# EAGLE design 1_cpu_mmu (EAGLE 6.6.0)

## Sheet 1 of 2
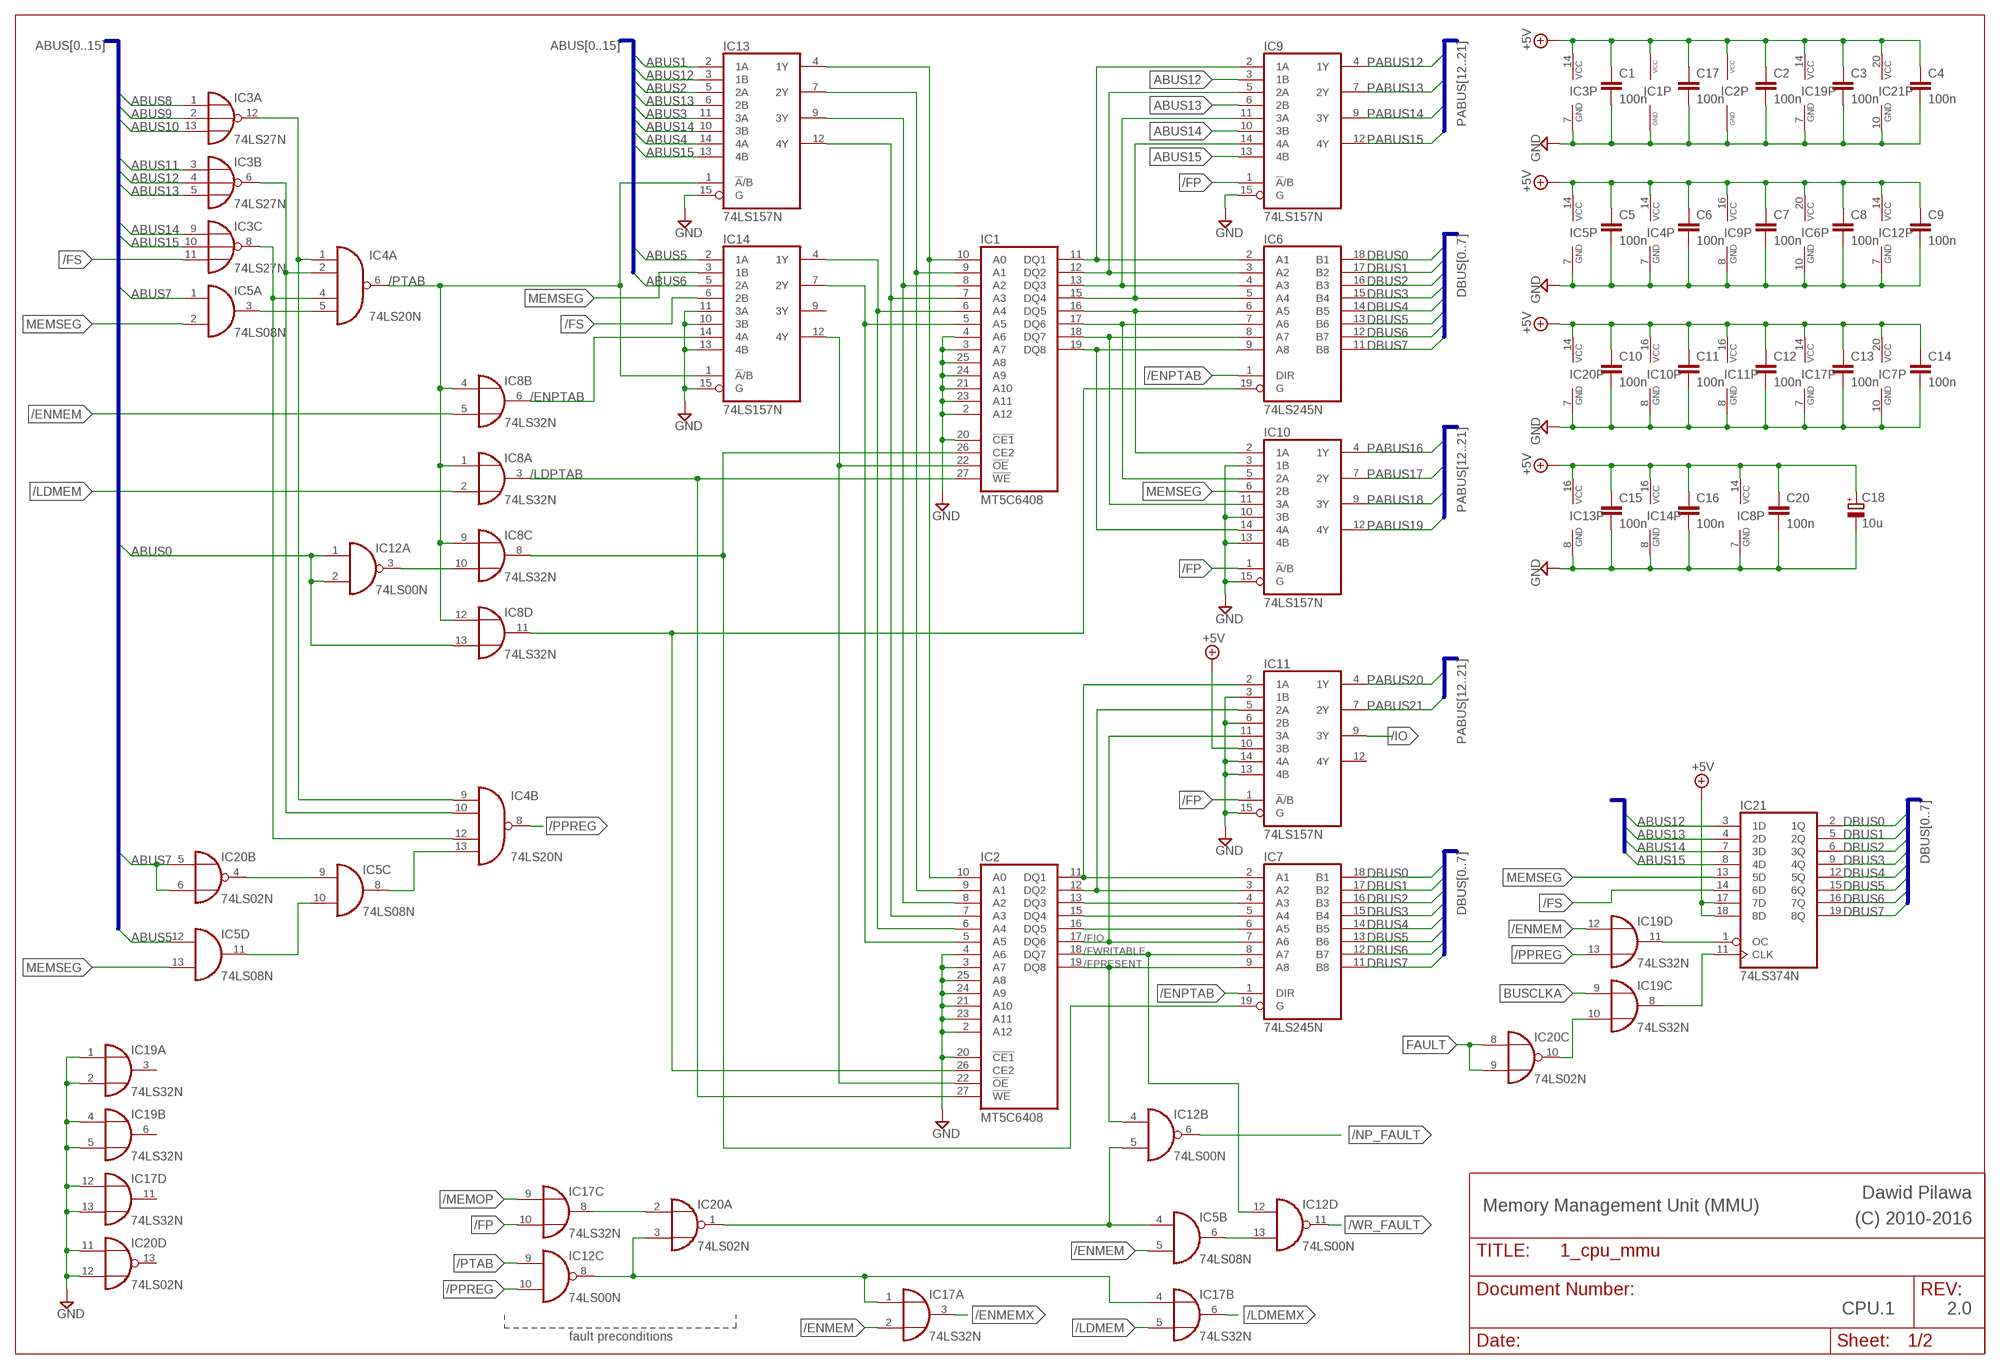
[diagram p0: schematic, sheet 1]

### Parts
C1  100n  C-EU050-024X044  [C050-024X044]
C2  100n  C-EU050-024X044  [C050-024X044]
C3  100n  C-EU050-024X044  [C050-024X044]
C4  100n  C-EU050-024X044  [C050-024X044]
C5  100n  C-EU050-024X044  [C050-024X044]
C6  100n  C-EU050-024X044  [C050-024X044]
C7  100n  C-EU050-024X044  [C050-024X044]
C8  100n  C-EU050-024X044  [C050-024X044]
C9  100n  C-EU050-024X044  [C050-024X044]
C10  100n  C-EU050-024X044  [C050-024X044]
C11  100n  C-EU050-024X044  [C050-024X044]
C12  100n  C-EU050-024X044  [C050-024X044]
C13  100n  C-EU050-024X044  [C050-024X044]
C14  100n  C-EU050-024X044  [C050-024X044]
C15  100n  C-EU050-024X044  [C050-024X044]
C16  100n  C-EU050-024X044  [C050-024X044]
C17  100n  C-EU050-024X044  [C050-024X044]
C18  10u  CPOL-EUE2.5-6  [E2,5-6]
C20  100n  C-EU050-024X044  [C050-024X044]
IC1  MT5C6408  [DIL28-3]
IC2  MT5C6408  [DIL28-3]
IC3  74LS27N  [DIL14]
IC4  74LS20N  [DIL14]
IC5  74LS08N  [DIL14]
IC6  74LS245N  [DIL20]
IC7  74LS245N  [DIL20]
IC8  74LS32N  [DIL14]
IC9  74LS157N  [DIL16]
IC10  74LS157N  [DIL16]
IC11  74LS157N  [DIL16]
IC12  74LS00N  [DIL14]
IC13  74LS157N  [DIL16]
IC14  74LS157N  [DIL16]
IC17  74LS32N  [DIL14]
IC19  74LS32N  [DIL14]
IC20  74LS02N  [DIL14]
IC21  74LS374N  [DIL20]

### Nets
+5V: C1.1 C2.1 C3.1 C4.1 C5.1 C6.1 C7.1 C8.1 C9.1 C10.1 C11.1 C12.1 C13.1 C14.1 C15.1 C16.1 C17.1 C18.+ C20.1 IC1.28(VCC) IC2.28(VCC) IC3.14(P:VCC) IC4.14(P:VCC) IC5.14(P:VCC) IC6.20(VCC) IC7.20(VCC) IC8.14(P:VCC) IC9.16(VCC) IC10.16(VCC) IC11.10(3B) IC11.16(VCC) IC12.14(P:VCC) IC13.16(VCC) IC14.16(VCC) IC17.14(P:VCC) IC19.14(P:VCC) IC20.14(P:VCC) IC21.17(7D) IC21.18(8D) IC21.20(VCC) ; also sheet 2
/ENMEM: IC5.5(B:I1) IC8.5(B:I1) IC17.2(A:I1) IC19.12(D:I0) ; also sheet 2
/ENMEMX: IC17.3(A:O) ; also sheet 2
/ENPTAB: IC6.1(DIR) IC7.1(DIR) IC8.6(B:O) IC14.14(4A)
/FIO: IC2.17(DQ6) IC7.7(A6) IC11.11(3A)
/FP: IC9.1(!A!/B) IC10.1(!A!/B) IC11.1(!A!/B) IC17.10(C:I1) ; also sheet 2
/FPRESENT: IC2.19(DQ8) IC7.9(A8) IC12.4(B:I0)
/FS: IC3.11(C:I2) IC14.6(2B) IC21.14(6D) ; also sheet 2
/FWRITABLE: IC2.18(DQ7) IC7.8(A7) IC12.12(D:I0)
/IO: IC11.9(3Y) ; also sheet 2
/LDMEM: IC8.2(A:I1) IC17.5(B:I1) ; also sheet 2
/LDMEMX: IC17.6(B:O) ; also sheet 2
/LDPTAB: IC1.27(!WE) IC2.27(!WE) IC8.3(A:O)
/MEMOP: IC17.9(C:I0) ; also sheet 2
/NP_FAULT: IC12.6(B:O) ; also sheet 2
/PPREG: IC4.8(B:O) IC12.10(C:I1) IC19.13(D:I1)
/PTAB: IC4.6(A:O) IC8.1(A:I0) IC8.4(B:I0) IC8.9(C:I0) IC8.12(D:I0) IC12.9(C:I0) IC13.1(!A!/B) IC14.1(!A!/B)
/WR_FAULT: IC12.11(D:O) ; also sheet 2
ABUS0: IC8.13(D:I1) IC12.1(A:I0) IC12.2(A:I1) ; also sheet 2
ABUS1: IC13.2(1A) ; also sheet 2
ABUS2: IC13.5(2A) ; also sheet 2
ABUS3: IC13.11(3A) ; also sheet 2
ABUS4: IC13.14(4A) ; also sheet 2
ABUS5: IC5.12(D:I0) IC14.2(1A) ; also sheet 2
ABUS6: IC14.5(2A) ; also sheet 2
ABUS7: IC5.1(A:I0) IC20.5(B:I0) IC20.6(B:I1) ; also sheet 2
ABUS8: IC3.1(A:I0) ; also sheet 2
ABUS9: IC3.2(A:I1) ; also sheet 2
ABUS10: IC3.13(A:I2) ; also sheet 2
ABUS11: IC3.3(B:I0) ; also sheet 2
ABUS12: IC3.4(B:I1) IC9.3(1B) IC13.3(1B) IC21.3(1D) ; also sheet 2
ABUS13: IC3.5(B:I2) IC9.6(2B) IC13.6(2B) IC21.4(2D) ; also sheet 2
ABUS14: IC3.9(C:I0) IC9.10(3B) IC13.10(3B) IC21.7(3D) ; also sheet 2
ABUS15: IC3.10(C:I1) IC9.13(4B) IC13.13(4B) IC21.8(4D) ; also sheet 2
BUSCLKA: IC19.9(C:I0) ; also sheet 2
DBUS0: IC6.18(B1) IC7.18(B1) IC21.2(1Q) ; also sheet 2
DBUS1: IC6.17(B2) IC7.17(B2) IC21.5(2Q) ; also sheet 2
DBUS2: IC6.16(B3) IC7.16(B3) IC21.6(3Q) ; also sheet 2
DBUS3: IC6.15(B4) IC7.15(B4) IC21.9(4Q) ; also sheet 2
DBUS4: IC6.14(B5) IC7.14(B5) IC21.12(5Q) ; also sheet 2
DBUS5: IC6.13(B6) IC7.13(B6) IC21.15(6Q) ; also sheet 2
DBUS6: IC6.12(B7) IC7.12(B7) IC21.16(7Q) ; also sheet 2
DBUS7: IC6.11(B8) IC7.11(B8) IC21.19(8Q) ; also sheet 2
FAULT: IC20.8(C:I0) IC20.9(C:I1) ; also sheet 2
GND: C1.2 C2.2 C3.2 C4.2 C5.2 C6.2 C7.2 C8.2 C9.2 C10.2 C11.2 C12.2 C13.2 C14.2 C15.2 C16.2 C17.2 C18.- C20.2 IC1.2(A12) IC1.3(A7) IC1.4(A6) IC1.14(GND) IC1.20(!CE1) IC1.21(A10) IC1.23(A11) IC1.24(A9) IC1.25(A8) IC2.2(A12) IC2.3(A7) IC2.4(A6) IC2.14(GND) IC2.20(!CE1) IC2.21(A10) IC2.23(A11) IC2.24(A9) IC2.25(A8) IC3.7(P:GND) IC4.7(P:GND) IC5.7(P:GND) IC6.10(GND) IC7.10(GND) IC8.7(P:GND) IC9.8(GND) IC9.15(G) IC10.3(1B) IC10.8(GND) IC10.10(3B) IC10.13(4B) IC10.15(G) IC11.3(1B) IC11.6(2B) IC11.8(GND) IC11.13(4B) IC11.14(4A) IC11.15(G) IC12.7(P:GND) IC13.8(GND) IC13.15(G) IC14.8(GND) IC14.10(3B) IC14.11(3A) IC14.13(4B) IC14.15(G) IC17.7(P:GND) IC17.12(D:I0) IC17.13(D:I1) IC19.1(A:I0) IC19.2(A:I1) IC19.4(B:I0) IC19.5(B:I1) IC19.7(P:GND) IC20.7(P:GND) IC20.11(D:I0) IC20.12(D:I1) IC21.10(GND) ; also sheet 2
MEMSEG: IC5.2(A:I1) IC5.13(D:I1) IC10.6(2B) IC14.3(1B) IC21.13(5D) ; also sheet 2
N$1: IC3.12(A:O) IC4.1(A:I0) IC4.9(B:I0)
N$2: IC3.6(B:O) IC4.2(A:I1) IC4.10(B:I1)
N$3: IC5.9(C:I0) IC20.4(B:O)
N$4: IC4.5(A:I3) IC5.3(A:O)
N$5: IC1.11(DQ1) IC6.2(A1) IC9.2(1A)
N$6: IC1.12(DQ2) IC6.3(A2) IC9.5(2A)
N$7: IC1.13(DQ3) IC6.4(A3) IC9.11(3A)
N$8: IC1.15(DQ4) IC6.5(A4) IC9.14(4A)
N$9: IC1.16(DQ5) IC6.6(A5) IC10.2(1A)
N$10: IC1.17(DQ6) IC6.7(A6) IC10.5(2A)
N$11: IC1.18(DQ7) IC6.8(A7) IC10.11(3A)
N$12: IC1.19(DQ8) IC6.9(A8) IC10.14(4A)
N$13: IC2.11(DQ1) IC7.2(A1) IC11.2(1A)
N$14: IC2.12(DQ2) IC7.3(A2) IC11.5(2A)
N$15: IC2.13(DQ3) IC7.4(A3)
N$16: IC2.15(DQ4) IC7.5(A4)
N$17: IC2.16(DQ5) IC7.6(A5)
N$20: IC17.8(C:O) IC20.2(A:I0)
N$21: IC1.10(A0) IC2.10(A0) IC13.4(1Y)
N$22: IC1.9(A1) IC2.9(A1) IC13.7(2Y)
N$23: IC1.8(A2) IC2.8(A2) IC13.9(3Y)
N$24: IC1.7(A3) IC2.7(A3) IC13.12(4Y)
N$25: IC1.6(A4) IC2.6(A4) IC14.4(1Y)
N$26: IC1.5(A5) IC2.5(A5) IC14.7(2Y)
N$27: IC1.26(CE2) IC7.19(G) IC8.8(C:O)
N$28: IC2.26(CE2) IC6.19(G) IC8.11(D:O)
N$29: IC1.22(!OE) IC2.22(!OE) IC14.12(4Y)
N$30: IC8.10(C:I1) IC12.3(A:O)
N$32: IC12.8(C:O) IC17.1(A:I0) IC17.4(B:I0) IC20.3(A:I1)
N$33: IC5.4(B:I0) IC12.5(B:I1) IC20.1(A:O)
N$34: IC5.6(B:O) IC12.13(D:I1)
N$36: IC5.10(C:I1) IC5.11(D:O)
N$37: IC3.8(C:O) IC4.4(A:I2) IC4.12(B:I2)
N$38: IC4.13(B:I3) IC5.8(C:O)
N$40: IC19.10(C:I1) IC20.10(C:O)
N$41: IC19.8(C:O) IC21.11(CLK)
N$42: IC19.11(D:O) IC21.1(OC)
PABUS12: IC9.4(1Y) ; also sheet 2
PABUS13: IC9.7(2Y) ; also sheet 2
PABUS14: IC9.9(3Y) ; also sheet 2
PABUS15: IC9.12(4Y) ; also sheet 2
PABUS16: IC10.4(1Y) ; also sheet 2
PABUS17: IC10.7(2Y) ; also sheet 2
PABUS18: IC10.9(3Y) ; also sheet 2
PABUS19: IC10.12(4Y) ; also sheet 2
PABUS20: IC11.4(1Y) ; also sheet 2
PABUS21: IC11.7(2Y) ; also sheet 2
Unconnected: IC11.12(4Y) IC14.9(3Y) IC17.11(D:O) IC19.3(A:O) IC19.6(B:O) IC20.13(D:O)

### Buses
ABUS[0..15]
DBUS[0..7]
PABUS[12..21]

### Notes on the sheet
- Dawid Pilawa
- Memory Management Unit (MMU) | (C) 2010-2016
- CPU.1 | 2.0
- fault preconditions

## Sheet 2 of 2
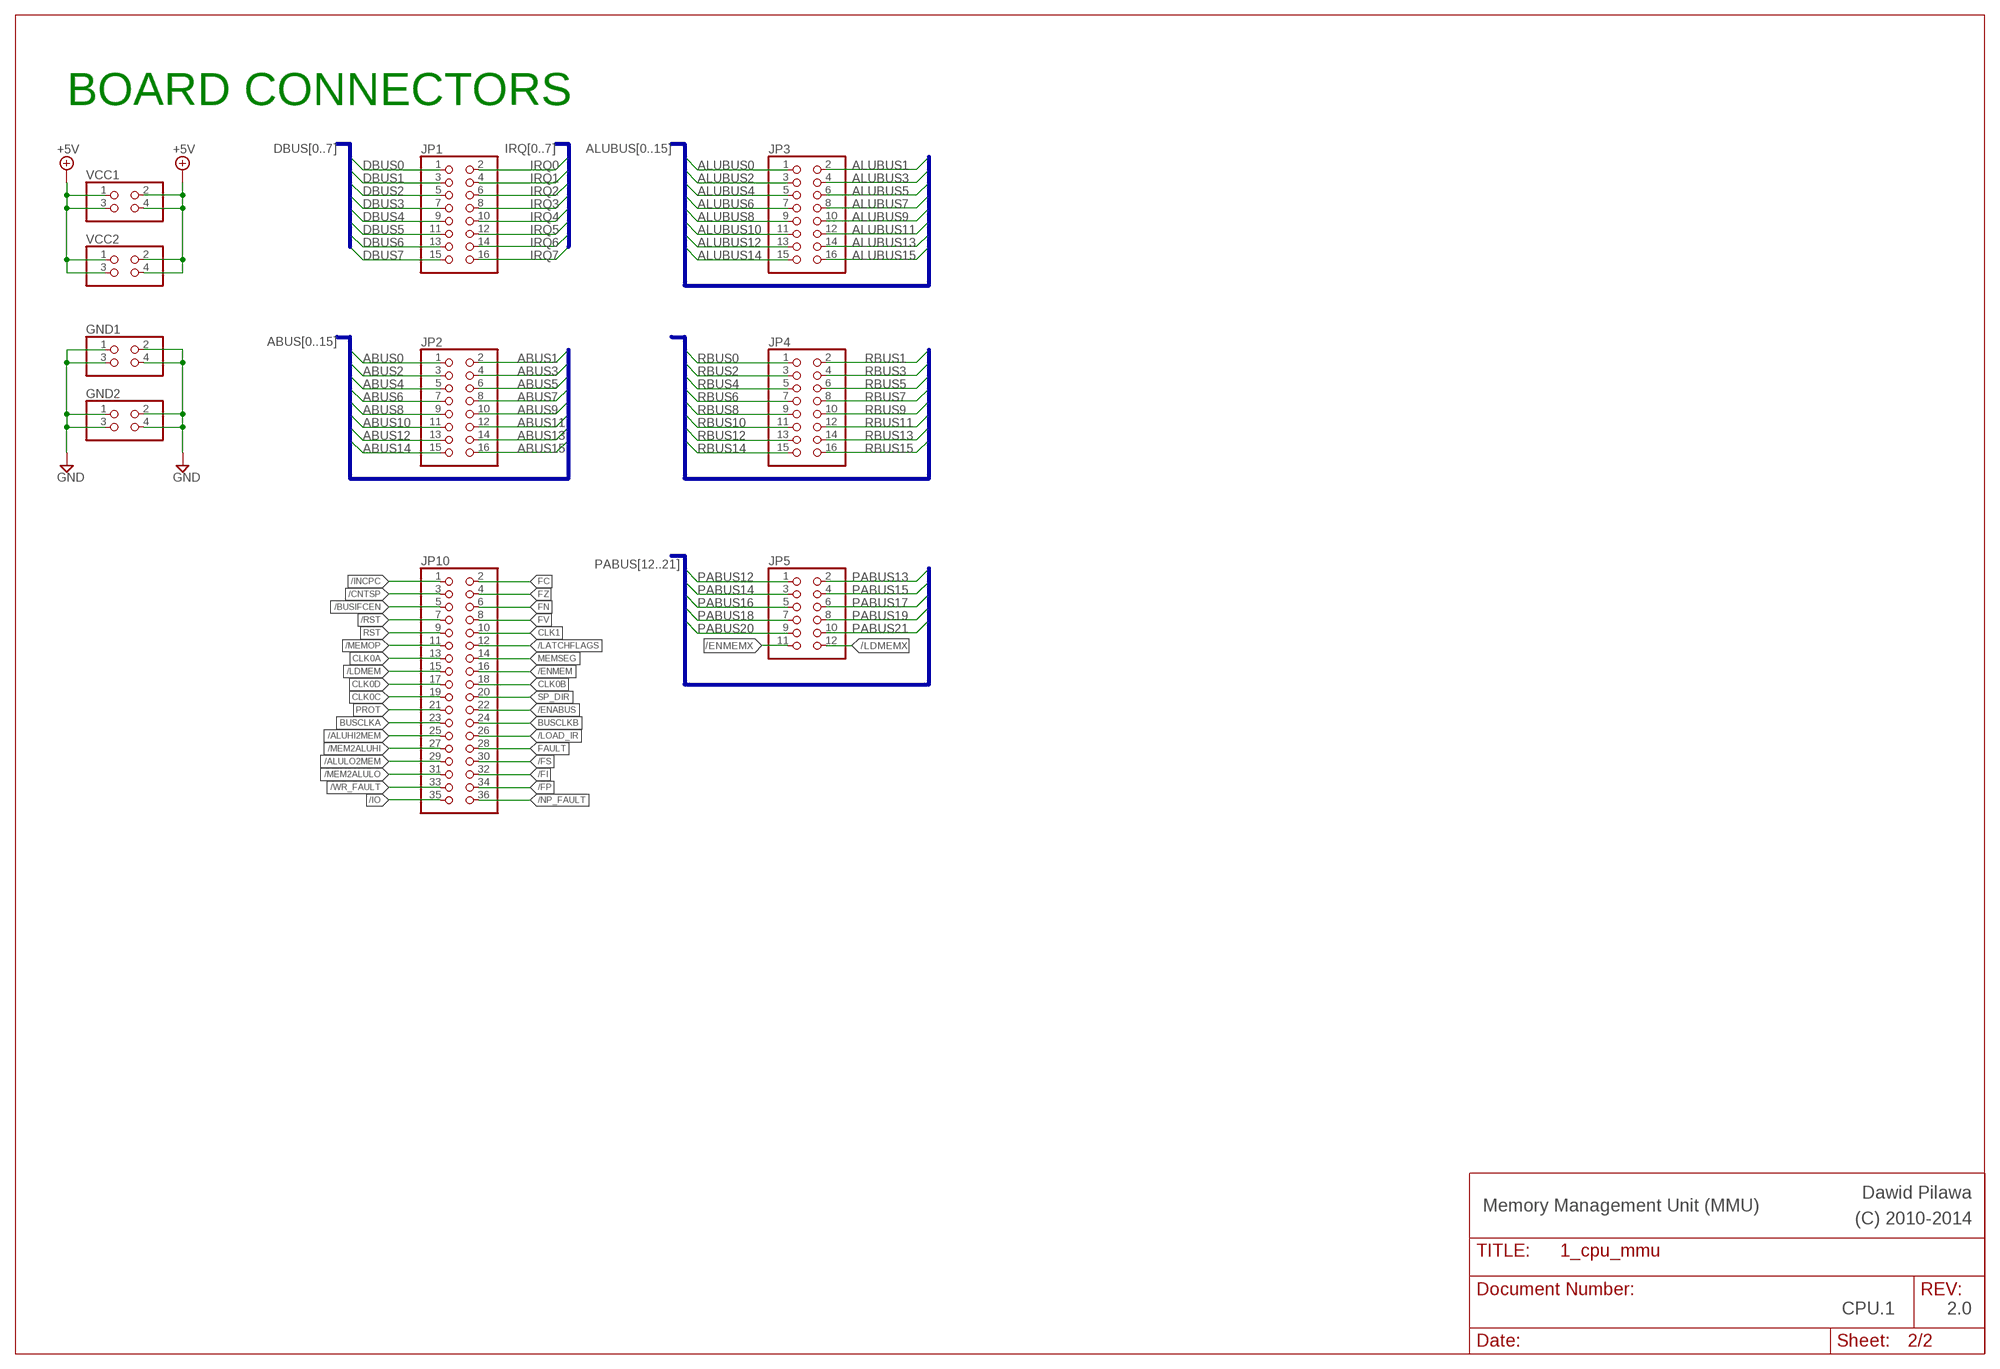
[diagram p1: schematic, sheet 2]

### Parts
GND1  PINHD-2X2  [2X02]
GND2  PINHD-2X2  [2X02]
JP1  PINHD-2X8  [2X08]
JP2  PINHD-2X8  [2X08]
JP3  PINHD-2X8  [2X08]
JP4  PINHD-2X8  [2X08]
JP5  PINHD-2X6  [2X06]
JP10  PINHD-2X18  [2X18]
VCC1  PINHD-2X2  [2X02]
VCC2  PINHD-2X2  [2X02]

### Nets
+5V: VCC1.1 VCC1.2 VCC1.3 VCC1.4 VCC2.1 VCC2.2 VCC2.3 VCC2.4 ; also sheet 1
/ALUHI2MEM: JP10.25
/ALULO2MEM: JP10.29
/BUSIFCEN: JP10.5
/CNTSP: JP10.3
/ENABUS: JP10.22
/ENMEM: JP10.16 ; also sheet 1
/ENMEMX: JP5.11 ; also sheet 1
/FI: JP10.32
/FP: JP10.34 ; also sheet 1
/FS: JP10.30 ; also sheet 1
/INCPC: JP10.1
/IO: JP10.35 ; also sheet 1
/LATCHFLAGS: JP10.12
/LDMEM: JP10.15 ; also sheet 1
/LDMEMX: JP5.12 ; also sheet 1
/LOAD_IR: JP10.26
/MEM2ALUHI: JP10.27
/MEM2ALULO: JP10.31
/MEMOP: JP10.11 ; also sheet 1
/NP_FAULT: JP10.36 ; also sheet 1
/RST: JP10.7
/WR_FAULT: JP10.33 ; also sheet 1
ABUS0: JP2.1 ; also sheet 1
ABUS1: JP2.2 ; also sheet 1
ABUS2: JP2.3 ; also sheet 1
ABUS3: JP2.4 ; also sheet 1
ABUS4: JP2.5 ; also sheet 1
ABUS5: JP2.6 ; also sheet 1
ABUS6: JP2.7 ; also sheet 1
ABUS7: JP2.8 ; also sheet 1
ABUS8: JP2.9 ; also sheet 1
ABUS9: JP2.10 ; also sheet 1
ABUS10: JP2.11 ; also sheet 1
ABUS11: JP2.12 ; also sheet 1
ABUS12: JP2.13 ; also sheet 1
ABUS13: JP2.14 ; also sheet 1
ABUS14: JP2.15 ; also sheet 1
ABUS15: JP2.16 ; also sheet 1
ALUBUS0: JP3.1
ALUBUS1: JP3.2
ALUBUS2: JP3.3
ALUBUS3: JP3.4
ALUBUS4: JP3.5
ALUBUS5: JP3.6
ALUBUS6: JP3.7
ALUBUS7: JP3.8
ALUBUS8: JP3.9
ALUBUS9: JP3.10
ALUBUS10: JP3.11
ALUBUS11: JP3.12
ALUBUS12: JP3.13
ALUBUS13: JP3.14
ALUBUS14: JP3.15
ALUBUS15: JP3.16
BUSCLKA: JP10.23 ; also sheet 1
BUSCLKB: JP10.24
CLK0A: JP10.13
CLK0B: JP10.18
CLK0C: JP10.19
CLK0D: JP10.17
CLK1: JP10.10
DBUS0: JP1.1 ; also sheet 1
DBUS1: JP1.3 ; also sheet 1
DBUS2: JP1.5 ; also sheet 1
DBUS3: JP1.7 ; also sheet 1
DBUS4: JP1.9 ; also sheet 1
DBUS5: JP1.11 ; also sheet 1
DBUS6: JP1.13 ; also sheet 1
DBUS7: JP1.15 ; also sheet 1
FAULT: JP10.28 ; also sheet 1
FC: JP10.2
FN: JP10.6
FV: JP10.8
FZ: JP10.4
GND: GND1.1 GND1.2 GND1.3 GND1.4 GND2.1 GND2.2 GND2.3 GND2.4 ; also sheet 1
IRQ0: JP1.2
IRQ1: JP1.4
IRQ2: JP1.6
IRQ3: JP1.8
IRQ4: JP1.10
IRQ5: JP1.12
IRQ6: JP1.14
IRQ7: JP1.16
MEMSEG: JP10.14 ; also sheet 1
PABUS12: JP5.1 ; also sheet 1
PABUS13: JP5.2 ; also sheet 1
PABUS14: JP5.3 ; also sheet 1
PABUS15: JP5.4 ; also sheet 1
PABUS16: JP5.5 ; also sheet 1
PABUS17: JP5.6 ; also sheet 1
PABUS18: JP5.7 ; also sheet 1
PABUS19: JP5.8 ; also sheet 1
PABUS20: JP5.9 ; also sheet 1
PABUS21: JP5.10 ; also sheet 1
PROT: JP10.21
RBUS0: JP4.1
RBUS1: JP4.2
RBUS2: JP4.3
RBUS3: JP4.4
RBUS4: JP4.5
RBUS5: JP4.6
RBUS6: JP4.7
RBUS7: JP4.8
RBUS8: JP4.9
RBUS9: JP4.10
RBUS10: JP4.11
RBUS11: JP4.12
RBUS12: JP4.13
RBUS13: JP4.14
RBUS14: JP4.15
RBUS15: JP4.16
RST: JP10.9
SP_DIR: JP10.20

### Buses
DBUS[0..7]
ALUBUS[0..15]
RBUS[0..15]
IRQ[0..7]
ABUS[0..15]
PABUS[12..21]

### Notes on the sheet
- BOARD CONNECTORS
- Dawid Pilawa
- Memory Management Unit (MMU) | (C) 2010-2014
- CPU.1 | 2.0

## Library data of the parts
C1-C17 C20 = rcl:C-EU: CAPACITOR, European symbol
C18 = rcl:CPOL-EU: POLARIZED CAPACITOR, European symbol
GND1 GND2 VCC1 VCC2 = pinhead:PINHD-2X2: PIN HEADER
IC1 IC2 = dawid:MT5C6408: 8K x 8 SRAM SRAM MEMORY ARRAY
IC3 = 74xx-eu:74*27: Triple 3-input NOR gate
IC4 = 74xx-eu:74*20: Dual 4-input NAND gate
IC5 = 74xx-eu:74*08: Quad 2-input AND gate
IC6 IC7 = 74xx-eu:74*245: Octal BUS TRANSCEIVER, 3-state
IC8 IC17 IC19 = 74xx-eu:74*32: Quad 2-input OR gate
IC9-IC11 IC13 IC14 = 74xx-eu:74*157: Quadruple 2-line to 1-line data SELECTOR/MULTIPLEXER
IC12 = 74xx-eu:74*00: Quad 2-input NAND gate
IC20 = 74xx-eu:74*02: Quad 2-input NOR gate
IC21 = 74xx-eu:74*374: Octal D type transparent LATCH, edge triggered
JP1-JP4 = pinhead:PINHD-2X8: PIN HEADER
JP5 = pinhead:PINHD-2X6: PIN HEADER
JP10 = pinhead:PINHD-2X18: PIN HEADER

## Board
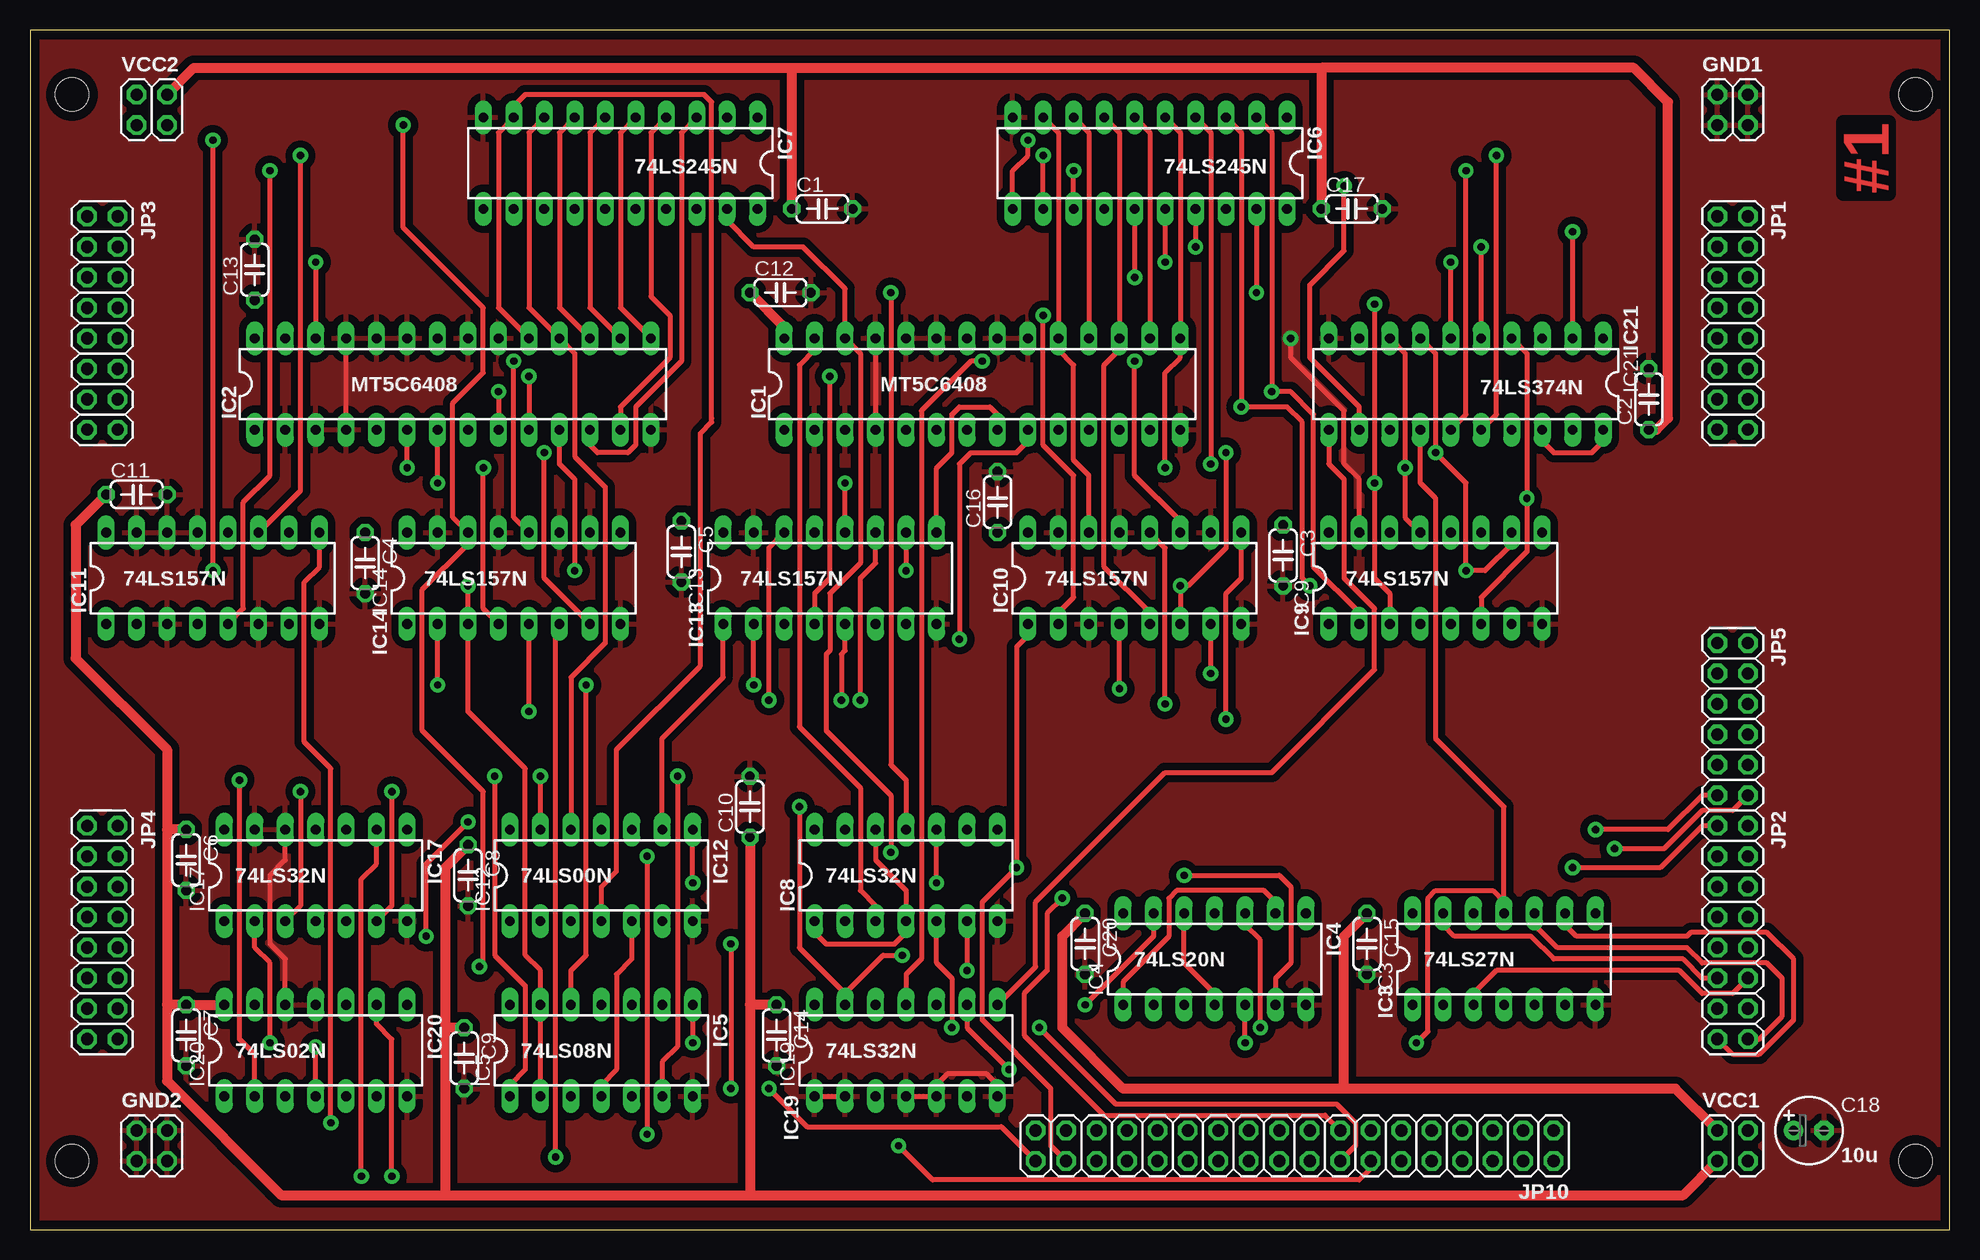
[diagram p2: board, top side]
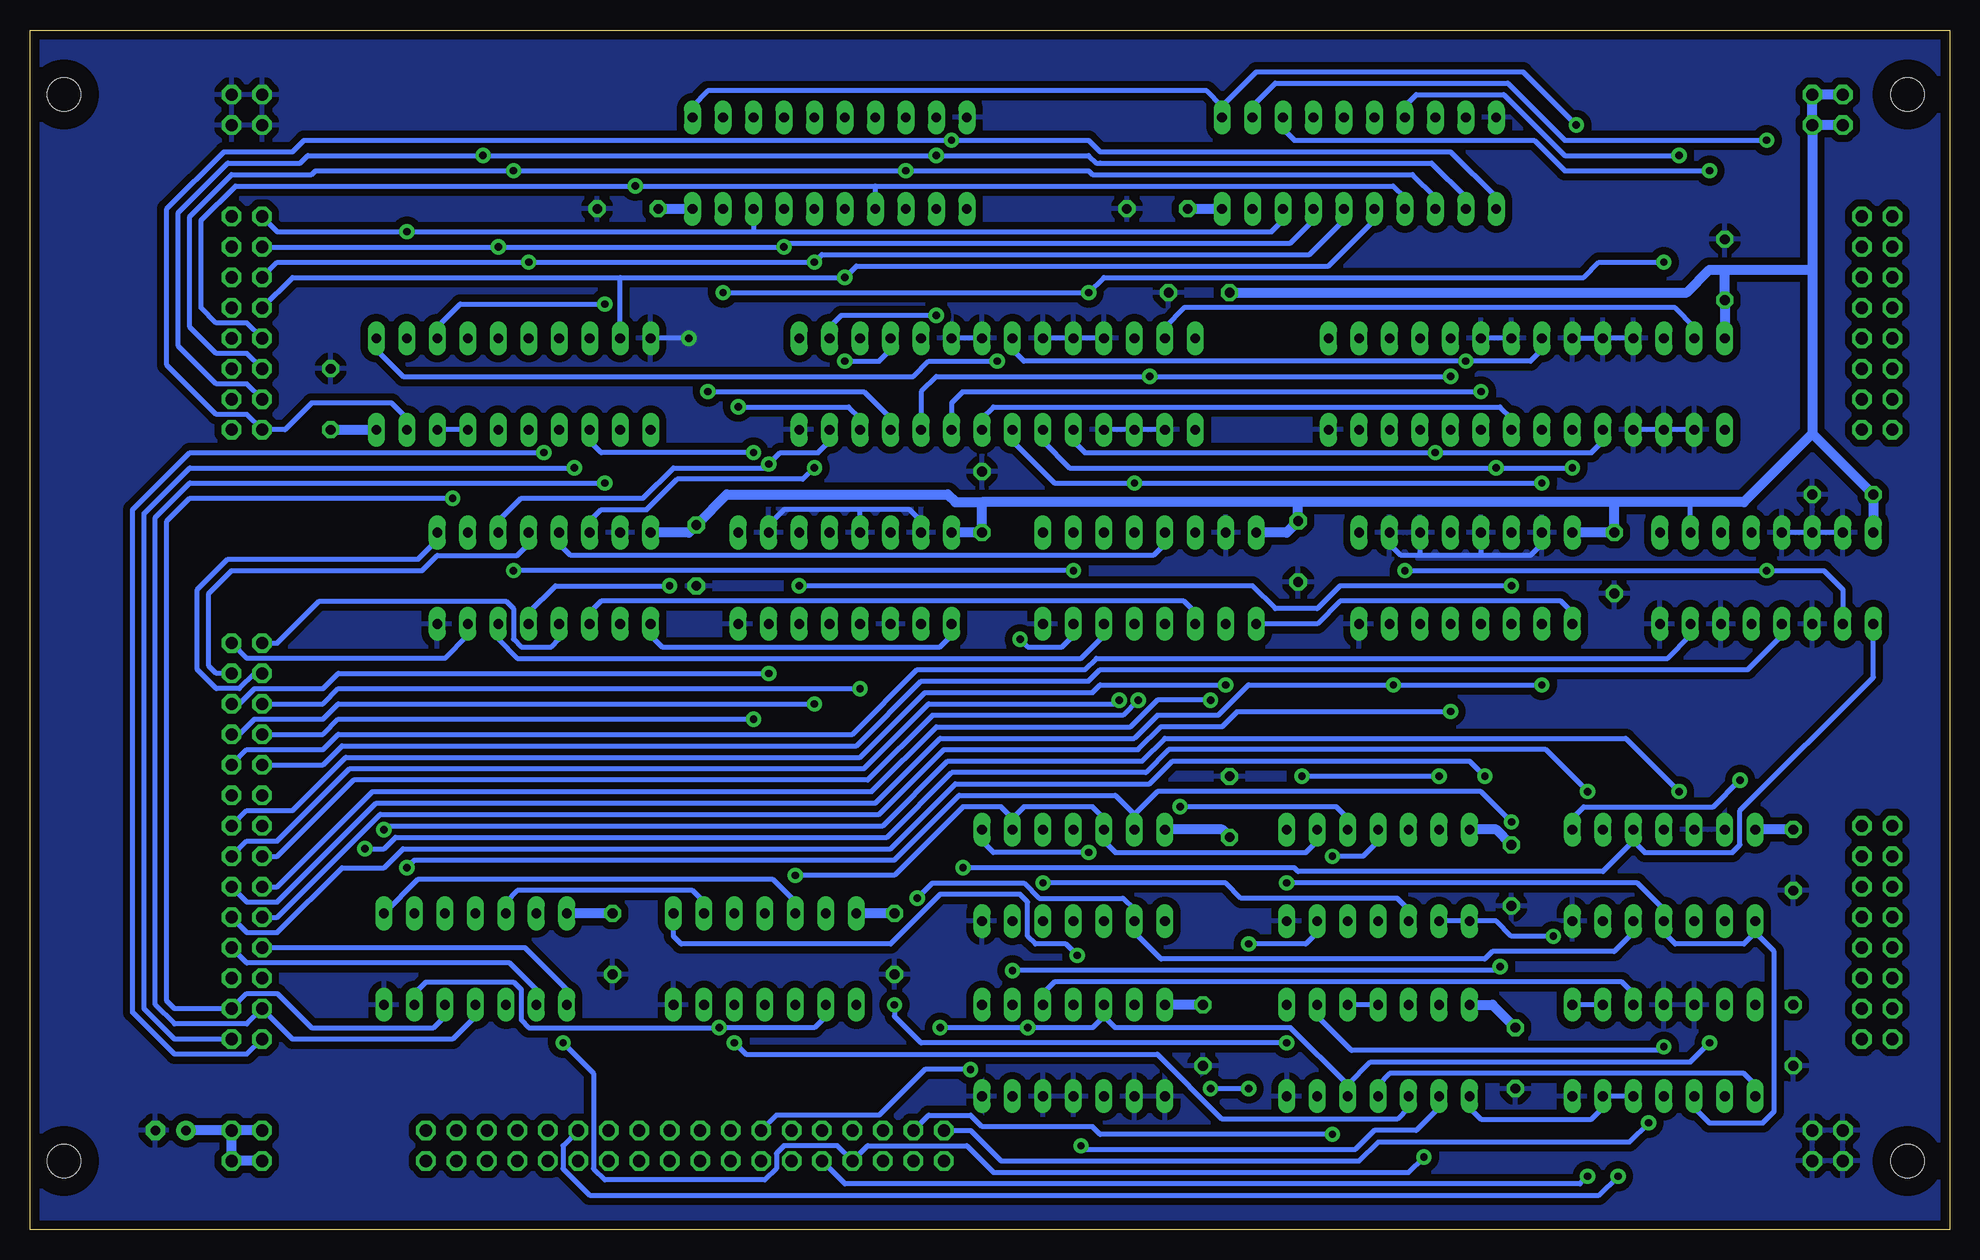
[diagram p3: board, bottom side, seen from below]

Size 160 x 100 mm. Coordinates in mm from the lower left corner, seen from the top.
Outline: 0,0 160,0 160,100 0,100 0,0
Copper layers (1*16): Top 0.035mm / dielectric 1.5mm / Bottom 0.035mm
Design rules "homebrew_pcb": minimum track width 16mil, minimum drill 24mil, track to track 16mil, track to pad 10mil, pad to pad 10mil, via to via 10mil, smd to smd 8mil, copper to edge 30mil, drill to drill 10mil, minimum pad ring 12mil, minimum via ring 12mil, stop-mask expansion 4mil, vias tented up to drill 0mil, thermal gap 24mil
Holes 2.79 mm at 3.49,94.61 3.49,5.71 157.16,94.61 157.16,5.71
bRestrict: area 1.2,92.3 to 5.8,96.9; area 154.9,92.3 to 159.4,96.9; area 154.9,3.4 to 159.4,8; area 1.2,3.4 to 5.8,8
vRestrict: area 1.2,92.3 to 5.8,96.9; area 1.2,3.4 to 5.8,8; area 154.9,3.4 to 159.4,8; area 154.9,92.3 to 159.4,96.9

### Footprints (pad centres in the part's own frame; a part is rotated, then mirrored left to right if it is on the bottom)
C050-024X044 = drill 0.813 octagon: 1 -2.54,0; 2 2.54,0
E2,5-6 = drill 0.813 pad 1.6: + -1.27,0 | drill 0.813 pad 1.6 octagon: - 1.27,0
2X02 = drill 1.016 octagon: 1 -1.27,-1.27; 2 -1.27,1.27; 3 1.27,-1.27; 4 1.27,1.27
DIL28-3 = drill 0.813 long: 1 -16.51,-3.81; 2 -13.97,-3.81; 3 -11.43,-3.81; 4 -8.89,-3.81; 5 -6.35,-3.81; 6 -3.81,-3.81; 7 -1.27,-3.81; 8 1.27,-3.81; 9 3.81,-3.81; 10 6.35,-3.81; 11 8.89,-3.81; 12 11.43,-3.81; 13 13.97,-3.81; 14 16.51,-3.81; 15 16.51,3.81; 16 13.97,3.81; 17 11.43,3.81; 18 8.89,3.81; 19 6.35,3.81; 20 3.81,3.81; 21 1.27,3.81; 22 -1.27,3.81; 23 -3.81,3.81; 24 -6.35,3.81; 25 -8.89,3.81; 26 -11.43,3.81; 27 -13.97,3.81; 28 -16.51,3.81
DIL14 = drill 0.813 long: 1 -7.62,-3.81; 2 -5.08,-3.81; 3 -2.54,-3.81; 4 0,-3.81; 5 2.54,-3.81; 6 5.08,-3.81; 7 7.62,-3.81; 8 7.62,3.81; 9 5.08,3.81; 10 2.54,3.81; 11 0,3.81; 12 -2.54,3.81; 13 -5.08,3.81; 14 -7.62,3.81
DIL20 = drill 0.813 long: 1 -11.43,-3.81; 2 -8.89,-3.81; 3 -6.35,-3.81; 4 -3.81,-3.81; 5 -1.27,-3.81; 6 1.27,-3.81; 7 3.81,-3.81; 8 6.35,-3.81; 9 8.89,-3.81; 10 11.43,-3.81; 11 11.43,3.81; 12 8.89,3.81; 13 6.35,3.81; 14 3.81,3.81; 15 1.27,3.81; 16 -1.27,3.81; 17 -3.81,3.81; 18 -6.35,3.81; 19 -8.89,3.81; 20 -11.43,3.81
DIL16 = drill 0.813 long: 1 -8.89,-3.81; 2 -6.35,-3.81; 3 -3.81,-3.81; 4 -1.27,-3.81; 5 1.27,-3.81; 6 3.81,-3.81; 7 6.35,-3.81; 8 8.89,-3.81; 9 8.89,3.81; 10 6.35,3.81; 11 3.81,3.81; 12 1.27,3.81; 13 -1.27,3.81; 14 -3.81,3.81; 15 -6.35,3.81; 16 -8.89,3.81
2X08 = drill 1.016 octagon: 1 -8.89,-1.27; 2 -8.89,1.27; 3 -6.35,-1.27; 4 -6.35,1.27; 5 -3.81,-1.27; 6 -3.81,1.27; 7 -1.27,-1.27; 8 -1.27,1.27; 9 1.27,-1.27; 10 1.27,1.27; 11 3.81,-1.27; 12 3.81,1.27; 13 6.35,-1.27; 14 6.35,1.27; 15 8.89,-1.27; 16 8.89,1.27
2X06 = drill 1.016 octagon: 1 -6.35,-1.27; 2 -6.35,1.27; 3 -3.81,-1.27; 4 -3.81,1.27; 5 -1.27,-1.27; 6 -1.27,1.27; 7 1.27,-1.27; 8 1.27,1.27; 9 3.81,-1.27; 10 3.81,1.27; 11 6.35,-1.27; 12 6.35,1.27
2X18 = drill 1.016 octagon: 1 -21.59,-1.27; 2 -21.59,1.27; 3 -19.05,-1.27; 4 -19.05,1.27; 5 -16.51,-1.27; 6 -16.51,1.27; 7 -13.97,-1.27; 8 -13.97,1.27; 9 -11.43,-1.27; 10 -11.43,1.27; 11 -8.89,-1.27; 12 -8.89,1.27; 13 -6.35,-1.27; 14 -6.35,1.27; 15 -3.81,-1.27; 16 -3.81,1.27; 17 -1.27,-1.27; 18 -1.27,1.27; 19 1.27,-1.27; 20 1.27,1.27; 21 3.81,-1.27; 22 3.81,1.27; 23 6.35,-1.27; 24 6.35,1.27; 25 8.89,-1.27; 26 8.89,1.27; 27 11.43,-1.27; 28 11.43,1.27; 29 13.97,-1.27; 30 13.97,1.27; 31 16.51,-1.27; 32 16.51,1.27; 33 19.05,-1.27; 34 19.05,1.27; 35 21.59,-1.27; 36 21.59,1.27

### Placement (x,y rotation side)
C1  66.04,85.09 0 top
C2  134.94,69.22 90 top
C3  104.46,56.2 270 top
C4  27.94,55.56 270 top
C5  54.29,56.52 270 top
C6  13.02,30.8 270 top
C7  13.02,16.19 270 top
C8  36.51,29.53 270 top
C9  36.2,14.29 270 top
C10  60.01,35.24 90 top
C11  8.89,61.28 0 top
C12  62.55,78.11 0 top
C13  18.73,80.01 90 top
C14  62.23,16.19 270 top
C15  111.44,23.81 270 top
C16  80.64,60.64 90 top
C17  110.17,85.09 0 top
C18  148.27,8.26 0 top
C20  87.95,23.81 270 top
GND1  141.92,93.34 0 top
GND2  10.16,6.99 0 top
IC1  79.38,70.48 0 top
IC2  35.24,70.48 0 top
IC3  122.87,22.54 0 top
IC4  98.74,22.54 0 top
IC5  47.62,14.92 0 top
IC6  93.34,88.9 180 top
IC7  49.21,88.9 180 top
IC8  73.03,29.53 0 top
IC9  117.16,54.29 0 top
IC10  92.08,54.29 0 top
IC11  15.24,54.29 0 top
IC12  47.62,29.53 0 top
IC13  66.67,54.29 0 top
IC14  40.32,54.29 0 top
IC17  23.81,29.53 0 top
IC19  73.03,14.92 0 top
IC20  23.81,14.92 0 top
IC21  119.7,70.48 180 top
JP1  141.92,75.56 270 top
JP2  141.92,24.77 270 top
JP3  6.03,75.56 270 top
JP4  6.03,24.77 270 top
JP5  141.92,42.55 270 top
JP10  105.41,6.99 180 top
VCC1  141.92,6.99 0 top
VCC2  10.16,93.34 0 top

### Tracks (layer width: path | path; a pad name or v marks a point on that pad's centre or on a via)
+5V
  Top 0.406: IC21.18 126.05,65.72 127,64.77 130.18,64.77 131.13,65.72 IC21.20
  Top 0.813: VCC2.4 13.65,96.84 63.5,96.84 | 63.5,96.84 107.63,96.84 | 107.63,96.84 C17.1 | C1.1 63.5,96.84 | C2.1 135.57,66.67 136.53,67.63 136.53,93.98 133.67,96.84 107.63,96.84 | C12.1 62.87,75.25 IC1.28 | 11.43,33.34 11.43,40.01 3.81,47.62 3.81,58.74 C11.1 | 11.43,33.34 11.43,18.73 | 11.43,18.73 11.43,12.38 20.95,2.86 34.61,2.86 | 34.61,2.86 60.01,2.86 | 60.01,2.86 137.79,2.86 VCC1.1 | VCC1.2 137.16,11.75 109.54,11.75 | 109.54,11.75 91.12,11.75 86.04,16.83 86.04,24.45 C20.1 | 109.54,11.75 109.54,24.45 C15.1 | 11.43,18.73 C7.1 IC20.14 | C6.1 11.43,33.34 | C8.1 34.61,30.16 34.61,16.83 | 34.61,16.83 34.61,2.86 | C9.1 34.61,16.83 | C10.1 60.01,18.73 | 60.01,18.73 60.01,2.86 | C14.1 60.01,18.73
  Bottom 0.406: IC21.17 IC21.18 | IC11.10 21.59,60.64
  Bottom 0.813: C17.1 IC6.20 | C1.1 IC7.20 | C2.1 IC21.20 | VCC2.3 VCC2.4 VCC2.2 | VCC2.1 VCC2.3 | 27.94,60.64 21.59,60.64 17.14,60.64 11.43,66.36 | 27.94,60.64 54.29,60.64 | 54.29,60.64 80.64,60.64 | VCC2.3 11.43,80.01 | 11.43,80.01 11.43,66.36 | 27.94,60.64 C4.1 IC14.16 | 54.29,60.64 C5.1 55.24,58.1 IC13.16 | IC9.16 105.09,58.1 C3.1 101.92,61.28 83.5,61.28 82.87,60.64 80.64,60.64 | IC11.16 C11.1 11.43,66.36 | IC2.28 C13.1 18.73,80.01 | C15.1 IC3.14 | C20.1 IC4.14 | C6.1 IC17.14 | C8.1 37.78,33.34 IC12.14 | IC5.14 38.1,18.73 C9.1 | C14.1 IC19.14 | C10.1 60.64,33.34 IC8.14 | VCC1.1 VCC1.3 VCC1.4 | VCC1.2 VCC1.4 | VCC1.4 C18.+ | 80.64,60.64 C16.1 IC10.16 | 18.73,80.01 20,80.01 21.91,78.11 C12.1 | 18.73,80.01 11.43,80.01
/ENMEM  (via drill 0.61 pad 1.27)
  Top 0.406: v20,15.56 20,22.23 18.73,23.5 IC17.2 | IC8.5 75.56,22.23 76.83,20.95 v76.83,16.83 | v84.14,16.83 90.49,10.48 108.9,10.48 110.49,8.89 110.49,6.99 JP10.16
  Bottom 0.406: IC5.5 50.16,12.06 | 50.16,12.06 48.26,13.97 21.59,13.97 v20,15.56 | 50.16,12.06 54.93,16.83 69.53,16.83 70.48,17.78 | IC19.12 70.48,17.78 | 70.48,17.78 71.44,16.83 v76.83,16.83 v84.14,16.83
/ENMEMX  (via drill 0.61 pad 1.27)
  Top 0.406: JP5.11 139.38,36.2 136.53,33.34 v130.49,33.34 | v22.54,36.51 22.54,26.99 IC17.3
  Bottom 0.406: v130.49,33.34 130.18,33.66 88.9,33.66 83.5,39.05 67.31,39.05 65.41,40.96 26.99,40.96 v22.54,36.51
/ENPTAB  (via drill 0.61 pad 1.27)
  Top 0.406: IC8.6 v78.11,21.59 | v37.47,21.91 37.78,22.23 37.78,36.51 32.7,41.59 32.7,53.34 36.51,57.15 IC14.14 35.24,59.37 35.24,68.9 37.78,71.44 37.78,76.83 31.11,83.5 v31.11,92.08
  Bottom 0.406: 60.64,93.66 61.91,94.93 103.5,94.93 104.78,93.66 IC6.1 | IC7.1 60.64,93.66 | 60.64,93.66 57.78,96.52 35.56,96.52 v31.11,92.08 | v37.47,21.91 37.78,21.59 v78.11,21.59
/FIO  (via drill 0.61 pad 1.27)
  Top 0.406: IC11.11 22.54,61.59 v22.54,89.53 | IC7.7 44.13,91.44 44.13,76.83 IC2.17
  Bottom 0.406: IC7.7 45.4,93.66 44.45,94.61 37.15,94.61 32.07,89.53 v22.54,89.53
/FP  (via drill 0.61 pad 1.27)
  Top 0.406: IC10.1 83.19,49.53 82.23,48.58 v82.23,30.16 79.38,27.3 79.38,17.46 85.09,11.75 85.09,6.99 JP10.34
  Bottom 0.406: IC9.1 108.27,49.53 107.31,48.58 84.14,48.58 83.19,49.53 IC10.1 | 26.35,32.38 28.89,29.84 54.29,29.84 54.61,30.16 v82.23,30.16 | IC17.10 26.35,32.38 | 26.35,32.38 25.4,31.43 18.1,31.43 17.46,32.07 17.46,34.92 6.35,46.04 IC11.1
/FPRESENT
  Top 0.406: IC2.19 39.05,76.83 39.05,91.44 IC7.9 40.32,93.66 41.27,94.61 56.2,94.61 56.83,93.98 56.83,67.63 56.83,67.31 55.88,66.36 55.88,46.99 48.9,40.01 48.9,29.84 47.62,28.57 IC12.4
/FS  (via drill 0.61 pad 1.27)
  Top 0.406: IC21.14 115.89,62.23 117.16,60.96 117.16,40.96 122.87,35.24 IC3.11 122.87,27.3 121.92,28.26 117.16,28.26 116.52,27.62 116.52,16.51 v115.57,15.56 | v43.81,6.03 43.81,49.53 44.13,49.85 IC14.6
  Bottom 0.406: v115.57,15.56 113.03,13.02 113.03,5.08 112.08,4.13 98.74,4.13 97.79,5.08 97.79,6.35 97.16,6.99 92.71,6.99 JP10.30 90.17,6.99 81.92,6.99 79.69,4.76 45.09,4.76 v43.81,6.03
/FWRITABLE
  Top 0.406: IC7.8 41.59,91.44 41.59,76.83 IC2.18 45.4,73.03 45.4,64.45 47.94,61.91 47.94,48.9 45.09,46.04 IC12.12
/IO  (via drill 0.61 pad 1.27)
  Top 0.406: v25.08,8.89 25.08,38.42 22.86,40.64 22.86,53.98 24.13,55.24 IC11.9
  Bottom 0.406: v25.08,8.89 26.67,7.3 47.62,7.3 49.21,5.71 79.06,5.71 81.6,8.26 JP10.35
/LDMEM  (via drill 0.61 pad 1.27)
  Top 0.406: v86.04,27.62 84.77,26.35 84.77,21.59 82.87,19.68 82.87,16.19 89.53,9.53 107.95,9.53 JP10.15
  Bottom 0.406: IC17.5 26.35,24.77 27.94,23.18 38.1,23.18 38.73,22.54 65.72,22.54 67.94,24.77 IC8.2 67.94,26.67 68.9,27.62 75.88,27.62 77.15,28.89 84.77,28.89 v86.04,27.62
/LDMEMX  (via drill 0.61 pad 1.27)
  Top 0.406: JP5.12 141.92,34.92 139.38,34.92 136.21,31.75 v132.08,31.75 | v30.16,36.51 30.16,26.99 IC17.6
  Bottom 0.406: v132.08,31.75 130.49,31.75 129.54,32.7 88.58,32.7 83.19,38.1 66.99,38.1 65.09,40.01 33.66,40.01 v30.16,36.51
/LDPTAB
  Top 0.406: IC1.27 65.41,73.34 64.14,72.07 64.14,41.91 69.22,36.83 69.22,28.26 70.48,26.99 IC8.3
  Bottom 0.406: IC2.27 21.27,75.25 22.86,76.83 63.82,76.83 65.41,75.25 IC1.27
/MEMOP  (via drill 0.61 pad 1.27)
  Top 0.406: v27.62,4.45 27.62,29.21 28.89,30.48 IC17.9
  Bottom 0.406: JP10.11 115.57,6.99 115.57,5.08 113.35,2.86 29.21,2.86 v27.62,4.45
/NP_FAULT  (via drill 0.61 pad 1.27)
  Top 0.406: v58.42,23.81 v58.42,11.75 | v61.59,11.75 64.77,8.57 80.96,8.57 JP10.36
  Bottom 0.406: IC12.6 52.7,24.77 53.66,23.81 v58.42,23.81 | v58.42,11.75 v61.59,11.75
/PPREG  (via drill 0.61 pad 1.27)
  Top 0.406: 67.94,19.68 64.14,23.5 v64.14,35.24 | 67.94,19.68 IC19.13 | 67.94,19.68 71.12,22.86 v72.71,22.86
  Bottom 0.406: IC12.10 50.16,34.29 51.12,35.24 v64.14,35.24 | IC4.8 106.36,24.45 105.73,23.81 88.27,23.81 84.14,27.94 77.47,27.94 76.83,27.3 76.83,24.45 76.2,23.81 73.66,23.81 v72.71,22.86
/PTAB  (via drill 0.61 pad 1.27)
  Top 0.406: IC8.12 70.48,30.8 73.03,28.26 IC8.4 73.03,24.77 72.07,23.81 66.36,23.81 65.41,24.77 IC8.1 | IC12.9 52.7,40.96 57.78,46.04 IC13.1 | v96.2,29.53 104.14,29.53 105.09,28.57 105.09,22.23 103.82,20.95 IC4.6
  Bottom 0.406: IC14.1 31.43,51.44 32.38,52.39 50.8,52.39 52.7,50.48 IC13.1 | 78.11,34.29 77.15,35.24 71.44,35.24 70.48,34.29 IC8.12 70.48,32.38 69.53,31.43 53.66,31.43 52.7,32.38 IC12.9 | IC8.9 78.11,34.29 | 78.11,34.29 79.06,35.24 82.23,35.24 87.95,29.53 v96.2,29.53
/WR_FAULT  (via drill 0.61 pad 1.27)
  Top 0.406: v51.44,31.11 v51.44,7.94
  Bottom 0.406: IC12.11 47.62,32.38 48.9,31.11 v51.44,31.11 | JP10.33 85.09,9.53 81.6,9.53 80.64,8.57 71.44,8.57 70.8,7.94 v51.44,7.94
ABUS0  (via drill 0.61 pad 1.27)
  Top 0.406: JP2.1 139.38,33.66 135.89,30.16 v128.59,30.16 | v36.51,33.97 33.02,30.48 v33.02,24.45
  Bottom 0.406: IC12.2 IC12.1 37.78,25.72 36.51,24.45 v33.02,24.45 | v128.59,30.16 127.95,30.8 87.95,30.8 82.55,36.2 69.53,36.2 67.94,34.61 | v36.51,33.97 39.05,36.51 66.04,36.51 67.94,34.61 | 67.94,34.61 IC8.13
ABUS1  (via drill 0.61 pad 1.27)
  Top 0.406: v60.33,45.4 IC13.2
  Bottom 0.406: JP2.2 141.92,34.92 138.11,34.92 133.67,39.37 90.81,39.37 85.41,44.77 71.44,44.77 70.8,45.4 v60.33,45.4
ABUS2  (via drill 0.61 pad 1.27)
  Top 0.406: v67.63,44.13 67.63,47.94 67.94,48.26 IC13.5
  Bottom 0.406: JP2.3 139.38,31.11 133.03,37.47 90.17,37.47 84.77,42.86 68.9,42.86 v67.63,44.13
ABUS3  (via drill 0.61 pad 1.27)
  Top 0.406: v69.22,44.13 69.22,54.29 70.48,55.56 IC13.11
  Bottom 0.406: JP2.4 141.92,32.38 139.38,32.38 133.35,38.42 90.49,38.42 85.09,43.81 69.53,43.81 v69.22,44.13
ABUS4  (via drill 0.61 pad 1.27)
  Top 0.406: v61.59,44.13 61.59,56.83 IC13.14
  Bottom 0.406: JP2.5 139.38,28.57 131.44,36.51 89.85,36.51 84.45,41.91 68.26,41.91 66.04,44.13 v61.59,44.13
ABUS5  (via drill 0.61 pad 1.27)
  Top 0.406: v33.97,45.4 IC14.2 | v46.35,45.4 46.35,22.86 45.09,21.59 IC5.12
  Bottom 0.406: v33.97,45.4 v46.35,45.4 58.42,45.4 60.96,42.86 66.04,42.86 67.94,40.96 84.14,40.96 89.53,35.56 131.13,35.56 139.38,27.3 141.92,27.3 JP2.6
ABUS6  (via drill 0.61 pad 1.27)
  Top 0.406: v41.59,43.18 IC14.5
  Bottom 0.406: JP2.7 139.38,26.04 130.81,34.61 89.22,34.61 83.82,40.01 67.63,40.01 65.72,41.91 60.64,41.91 59.37,43.18 v41.59,43.18
ABUS7  (via drill 0.61 pad 1.27)
  Top 0.406: v38.73,37.78 38.73,22.86 41.27,20.32 41.27,13.34 40.01,12.06 IC5.1
  Bottom 0.406: JP2.8 141.92,24.77 139.38,24.77 133.99,30.16 130.49,30.16 128.91,31.75 88.27,31.75 82.87,37.15 66.67,37.15 64.77,39.05 40.01,39.05 v38.73,37.78 | IC20.5 IC20.6 28.89,10.16 29.84,9.21 39.05,9.21 40.01,10.16 IC5.1
ABUS8
  Bottom 0.406: IC3.1 115.25,20 118.75,23.5 JP2.9
ABUS9
  Bottom 0.406: IC3.2 117.79,20 120.02,22.23 141.92,22.23 JP2.10
ABUS10
  Top 0.406: IC3.13 117.79,25.4 118.75,24.45 125.09,24.45 127,22.54 137.79,22.54 139.38,20.95 JP2.11
ABUS11
  Top 0.406: JP2.12 141.92,19.68 139.38,19.68 137.48,21.59 122.24,21.59 120.33,19.68 IC3.3
ABUS12  (via drill 0.61 pad 1.27)
  Top 0.406: v112.08,77.15 v112.08,62.23 112.08,54.29 113.35,53.02 IC9.3
  Bottom 0.406: IC21.3 126.05,75.25 124.14,77.15 v112.08,77.15 | v112.08,62.23 146.69,62.23 149.54,59.37 149.54,18.73 147.96,17.14 141.92,17.14 JP2.13 138.11,15.88 124.78,15.88 122.87,17.78 IC3.4 | IC13.3 62.87,51.44 63.82,52.39 112.39,52.39 113.35,51.44 IC9.3
ABUS13  (via drill 0.61 pad 1.27)
  Top 0.406: IC21.4 124.78,73.03 v124.78,60.96 124.78,56.52 120.97,52.7 IC9.6
  Bottom 0.406: v124.78,60.96 146.69,60.96 148.59,59.05 148.59,19.05 147.96,18.41 JP2.14 141.92,19.68 139.38,19.68 136.53,16.83 126.36,16.83 125.41,17.78 IC3.5 | IC9.6 120.97,49.21 119.38,47.62 72.39,47.62 70.48,49.53 IC13.6
ABUS14  (via drill 0.61 pad 1.27)
  Top 0.406: IC21.7 117.16,73.03 v117.16,64.77 119.7,62.23 v119.7,54.93 121.28,54.93 123.51,57.15 IC9.10 | IC13.10 v73.03,54.93 | JP2.15 141.92,14.61 144.15,14.61 147,17.46 147,22.54 144.78,24.77 138.43,24.77 138.11,24.45 128.91,24.45 127.95,25.4 IC3.9
  Bottom 0.406: JP2.15 141.92,14.61 147.96,14.61 151.45,18.1 151.45,60.01 146.69,64.77 v117.16,64.77 | v73.03,54.93 v119.7,54.93
ABUS15  (via drill 0.61 pad 1.27)
  Top 0.406: IC21.8 114.62,73.03 v114.62,63.5 114.62,59.37 IC9.13 | JP2.16 144.15,15.88 146.05,17.78 146.05,20.95 144.78,22.23 139.38,22.23 138.11,23.5 127.32,23.5 125.41,25.4 IC3.10
  Bottom 0.406: JP2.16 147.96,15.88 150.5,18.41 150.5,59.69 146.69,63.5 v114.62,63.5 | IC13.13 65.41,57.15 66.36,56.2 114.94,56.2 115.89,57.15 IC9.13
BUSCLKA  (via drill 0.61 pad 1.27)
  Top 0.406: IC19.9 78.11,16.83 v81.6,13.34
  Bottom 0.406: v81.6,13.34 85.41,13.34 89.22,9.53 97.79,9.53 JP10.23
DBUS0  (via drill 0.61 pad 1.27)
  Top 0.406: IC21.2 v128.59,83.19
  Bottom 0.406: JP1.1 139.38,83.19 v128.59,83.19 99.69,83.19 | 99.69,83.19 56.52,83.19 55.56,84.14 IC7.18 | IC6.18 99.69,83.19
DBUS1  (via drill 0.61 pad 1.27)
  Top 0.406: IC6.17 v97.16,81.92 | IC21.5 v120.97,81.92
  Bottom 0.406: JP1.3 v120.97,81.92 v97.16,81.92 96.84,82.23 54.93,82.23 53.02,84.14 IC7.17
DBUS2  (via drill 0.61 pad 1.27)
  Top 0.406: IC6.16 v94.61,80.64 | IC21.6 v118.43,80.64
  Bottom 0.406: JP1.5 139.38,80.64 v118.43,80.64 v94.61,80.64 93.98,81.28 53.34,81.28 50.48,84.14 IC7.16
DBUS3  (via drill 0.61 pad 1.27)
  Top 0.406: IC6.15 v92.08,79.38
  Bottom 0.406: JP1.7 138.11,79.38 110.81,79.38 | 110.81,79.38 v92.08,79.38 91.12,80.33 51.75,80.33 47.94,84.14 IC7.15 | IC21.9 110.81,79.38
DBUS4  (via drill 0.61 pad 1.27)
  Top 0.406: v109.54,87 109.54,81.6 106.68,78.74 106.68,72.71 110.81,68.58 IC21.12
  Bottom 0.406: JP1.9 141.92,75.56 144.46,75.56 145.73,76.83 145.73,84.14 142.88,87 v109.54,87 89.53,87 | 89.53,87 46.35,87 45.4,86.04 IC7.14 | IC6.14 89.53,87
DBUS5  (via drill 0.61 pad 1.27)
  Top 0.406: IC6.13 v87,88.27 | IC21.15 119.7,67.94 v119.7,88.27
  Bottom 0.406: JP1.11 141.92,73.03 144.46,73.03 146.69,75.25 146.69,84.45 143.19,87.95 136.53,87.95 136.21,88.27 v119.7,88.27 v87,88.27 71.75,88.27 71.44,87.95 44.77,87.95 42.86,86.04 IC7.13
DBUS6  (via drill 0.61 pad 1.27)
  Top 0.406: IC6.12 v84.45,89.53 | IC21.16 122.24,67.94 v122.24,89.53
  Bottom 0.406: JP1.13 141.92,70.48 144.46,70.48 147.64,73.66 147.64,84.77 143.51,88.9 137.48,88.9 136.84,89.53 v122.24,89.53 v84.45,89.53 71.75,89.53 71.12,88.9 70.8,88.9 43.18,88.9 40.32,86.04 IC7.12
DBUS7  (via drill 0.61 pad 1.27)
  Top 0.406: IC6.11 81.92,88.27 83.19,89.53 v83.19,90.81
  Bottom 0.406: IC7.11 37.78,86.04 41.59,89.85 70.8,89.85 71.75,90.81 v83.19,90.81 137.16,90.81 138.11,89.85 143.83,89.85 148.59,85.09 148.59,72.07 144.46,67.94 141.92,67.94 JP1.15 138.75,66.67 136.53,68.9 129.86,68.9 128.59,67.63 IC21.19
FAULT  (via drill 0.61 pad 1.27)
  Top 0.406: v30.16,4.45 30.16,15.88 28.89,17.14 IC20.9
  Bottom 0.406: IC20.9 IC20.8 | JP10.28 92.08,3.81 30.8,3.81 v30.16,4.45
GND  (via drill 0.61 pad 1.27)
  Top 0.406: IC2.4 IC2.25 | IC1.25 IC1.4 | IC20.12 21.27,22.54 20,23.81 20,29.53 21.27,30.8 IC17.12 | IC19.4 IC19.5 75.56,12.06 76.52,13.02 79.69,13.02 80.64,12.06 IC19.7 | IC19.1 IC19.2 | IC9.15 110.81,62.55 109.54,63.82 109.54,68.26 105.09,72.71 v105.09,74.3
  Bottom 0.406: IC2.2 IC2.3 IC2.4 | IC2.25 IC2.24 IC2.23 | IC2.21 IC2.20 | IC1.2 IC1.3 IC1.4 | IC1.23 IC1.24 IC1.25 | IC1.21 IC1.20 | IC11.15 IC11.14 IC11.13 | IC14.15 33.97,57.15 34.92,56.2 39.05,56.2 | 39.05,56.2 44.13,56.2 | 44.13,56.2 45.72,56.2 46.67,57.15 IC14.10 | IC14.11 44.13,56.2 | IC14.13 39.05,56.2 | IC10.15 85.72,59.05 86.68,60.01 90.81,60.01 | 90.81,60.01 97.16,60.01 98.42,58.74 IC10.10 | IC10.13 90.81,60.01 | v105.09,74.3 IC21.10
  pour Bottom (isolate 0.61): 0,100.01 160.02,100.01 160.02,0 0,0
  pour Top (isolate 0.61): 0,100.01 160.02,100.01 160.02,0 0,0
MEMSEG  (via drill 0.61 pad 1.27)
  Top 0.406: v36.51,53.66 IC14.3 36.51,43.18 41.27,38.42 41.27,22.86 42.55,21.59 IC5.13 IC5.2 | IC10.6 v95.89,53.66 96.52,53.66 99.69,56.83 v99.69,64.77 | JP10.14 111.76,5.08 110.81,4.13 75.25,4.13 v72.39,6.99
  Bottom 0.406: v99.69,64.77 112.39,64.77 113.35,65.72 IC21.13 | v36.51,53.66 50.8,53.66 52.7,51.75 56.2,51.75 58.1,53.66 v95.89,53.66 | v72.39,6.99 72.07,6.67 49.53,6.67 47.94,8.26 44.45,8.26 42.55,10.16 IC5.2
N$1
  Top 0.406: IC4.9 103.82,27.3 102.87,28.26 95.57,28.26 94.93,27.62 94.93,24.45 93.34,22.86 93.03,22.54 91.12,20.64 IC4.1
  Bottom 0.406: IC4.9 103.82,27.3 104.78,28.26 119.38,28.26 120.33,27.3 IC3.12
N$2  (via drill 0.61 pad 1.27)
  Top 0.406: v102.55,16.83 102.55,24.13 101.28,25.4 IC4.10
  Bottom 0.406: IC3.6 127.95,19.68 127,20.64 119.7,20.64 119.06,20 119.06,17.46 118.43,16.83 v102.55,16.83 94.61,16.83 93.66,17.78 IC4.2
N$3  (via drill 0.61 pad 1.27)
  Top 0.406: IC20.4 v23.81,15.24
  Bottom 0.406: v23.81,15.24 24.13,14.92 49.85,14.92 52.7,17.78 IC5.9
N$4  (via drill 0.61 pad 1.27)
  Top 0.406: v101.28,15.56 IC4.5
  Bottom 0.406: IC5.3 45.09,10.16 46.04,9.21 60.64,9.21 66.04,14.61 100.33,14.61 v101.28,15.56
N$5  (via drill 0.61 pad 1.27)
  Top 0.406: IC6.2 103.5,91.44 v103.5,69.85 105.09,69.85 107,67.94 107,55.24 110.81,51.44 IC9.2
  Bottom 0.406: v103.5,69.85 90.49,69.85 88.27,67.63 IC1.11
N$6  (via drill 0.61 pad 1.27)
  Top 0.406: IC6.3 100.97,91.44 v100.97,68.58 104.78,68.58 106.05,67.31 106.05,54.29 v106.68,53.66
  Bottom 0.406: v100.97,68.58 91.76,68.58 90.81,67.63 IC1.12 | IC9.5 118.43,51.44 116.2,53.66 v106.68,53.66
N$7  (via drill 0.61 pad 1.27)
  Top 0.406: IC6.4 98.42,91.44 v98.42,63.82
  Bottom 0.406: IC9.11 120.97,59.05 119.06,60.96 108.9,60.96 106.36,63.5 99.06,63.5 98.74,63.5 v98.42,63.82 97.47,64.77 94.3,64.77 93.34,65.72 IC1.13
N$8  (via drill 0.61 pad 1.27)
  Top 0.406: IC6.5 95.89,91.44 IC1.15 95.89,72.71 94.61,71.44 v94.61,63.5
  Bottom 0.406: IC9.14 113.35,59.05 112.39,60.01 108.58,60.01 106.05,62.55 95.57,62.55 v94.61,63.5
N$9  (via drill 0.61 pad 1.27)
  Top 0.406: IC6.6 93.34,91.44 IC1.16 | IC10.2 85.72,51.44 87,52.7 87,62.87 84.45,65.41 v84.45,76.2
  Bottom 0.406: v84.45,76.2 92.39,76.2 93.34,75.25 IC1.16
N$10
  Top 0.406: IC6.7 90.81,91.44 IC1.17 90.81,73.34 89.53,72.07 89.53,55.24 93.34,51.44 IC10.5
N$11  (via drill 0.61 pad 1.27)
  Top 0.406: IC6.8 88.27,91.44 IC1.18 | IC10.11 95.89,59.05 92.08,62.87 v92.08,72.39
  Bottom 0.406: v92.08,72.39 89.22,72.39 88.27,73.34 IC1.18
N$12
  Top 0.406: IC6.9 85.72,91.44 IC1.19 85.72,73.34 87,72.07 87,64.14 88.27,62.87 IC10.14
N$13  (via drill 0.61 pad 1.27)
  Top 0.406: v45.4,54.93 45.4,62.55 44.13,63.82 IC2.11 | v15.24,90.81 v15.24,54.93
  Bottom 0.406: v45.4,54.93 v15.24,54.93 10.48,54.93 8.89,53.34 IC11.2 | IC7.2 58.1,93.66 56.2,95.57 36.83,95.57 32.07,90.81 v15.24,90.81
N$14  (via drill 0.61 pad 1.27)
  Top 0.406: IC2.12 46.67,65.41 47.31,64.77 49.85,64.77 50.48,65.41 50.48,68.58 54.29,72.39 54.29,91.44 IC7.3 | IC11.5 17.78,51.75 17.78,60.64 20,62.87 v20,88.27
  Bottom 0.406: IC7.3 55.56,91.76 54.61,90.81 34.61,90.81 32.07,88.27 v20,88.27
N$15
  Top 0.406: IC2.13 49.21,68.58 53.34,72.71 53.34,76.2 51.75,77.79 51.75,91.44 IC7.4
N$16
  Top 0.406: IC7.5 49.21,91.44 49.21,76.83 IC2.15
N$17
  Top 0.406: IC7.6 46.67,91.44 46.67,76.83 IC2.16
N$20  (via drill 0.61 pad 1.27)
  Top 0.406: IC20.2 18.73,14.61 17.46,15.88 v17.46,37.47
  Bottom 0.406: IC17.8 31.43,34.29 30.48,35.24 19.68,35.24 v17.46,37.47
N$21  (via drill 0.61 pad 1.27)
  Top 0.406: v41.59,71.12 IC2.10 | v66.67,71.12 66.67,54.29 65.41,53.02 IC13.4
  Bottom 0.406: 85.72,67.63 IC1.10 85.72,69.85 84.45,71.12 v66.67,71.12 v41.59,71.12
N$22  (via drill 0.61 pad 1.27)
  Top 0.406: v39.05,69.85 IC2.9 | v77.47,49.21 77.47,63.82 78.42,64.77 82.23,64.77 83.19,65.72 IC1.9
  Bottom 0.406: v39.05,69.85 82.23,69.85 83.19,68.9 IC1.9 | v77.47,49.21 76.83,48.58 73.98,48.58 73.03,49.53 IC13.7
N$23
  Top 0.406: IC13.9 75.56,63.5 76.83,64.77 76.83,67.94 77.47,68.58 80.01,68.58 80.64,67.94 IC1.8
  Bottom 0.406: IC1.8 80.64,67.63 79.69,68.58 37.47,68.58 36.51,67.63 IC2.8
N$24  (via drill 0.61 pad 1.27)
  Top 0.406: v33.97,62.23 IC2.7 | IC13.12 v67.94,62.23
  Bottom 0.406: IC1.7 78.11,65.72 74.61,62.23 v67.94,62.23 v33.97,62.23
N$25  (via drill 0.61 pad 1.27)
  Top 0.406: v31.43,63.5 IC2.6 | IC14.4 37.78,51.75 v37.78,63.5
  Bottom 0.406: IC1.6 75.56,65.72 73.34,63.5 v37.78,63.5 v31.43,63.5
N$26  (via drill 0.61 pad 1.27)
  Top 0.406: IC14.7 42.86,54.29 v42.86,64.77
  Bottom 0.406: IC1.5 73.03,65.72 72.07,64.77 v42.86,64.77 29.84,64.77 28.89,65.72 IC2.5
N$27  (via drill 0.61 pad 1.27)
  Top 0.406: v71.75,31.43 71.75,36.2 66.36,41.59 66.36,47.94 66.67,48.26 66.67,53.02 69.22,55.56 69.22,73.03 IC1.26 67.94,78.42 64.45,81.92 60.33,81.92 58.1,84.14 IC7.19
  Bottom 0.406: v71.75,31.43 79.69,31.43 80.64,32.38 IC8.8
N$28  (via drill 0.61 pad 1.27)
  Top 0.406: IC6.19 v102.23,78.11 | v71.75,78.11 71.75,38.73 73.03,37.47 IC8.11 | v23.81,80.64 IC2.26
  Bottom 0.406: v102.23,78.11 v71.75,78.11 70.48,79.38 30.48,79.38 29.21,80.64 v23.81,80.64
N$29  (via drill 0.61 pad 1.27)
  Top 0.406: IC14.12 40.32,59.37 v40.32,72.39
  Bottom 0.406: IC2.22 33.97,73.34 34.92,72.39 v40.32,72.39 77.15,72.39 78.11,73.34 IC1.22
N$30  (via drill 0.61 pad 1.27)
  Top 0.406: v75.56,28.89 IC8.10
  Bottom 0.406: IC12.3 45.09,26.67 46.04,27.62 59.05,27.62 60.33,28.89 v75.56,28.89
N$32  (via drill 0.61 pad 1.27)
  Top 0.406: v55.24,28.89 IC12.8
  Bottom 0.406: 16.19,24.77 17.14,23.81 22.86,23.81 23.81,24.77 IC17.4 23.81,26.67 26.04,28.89 v55.24,28.89 | IC20.3 21.27,10.16 20,8.89 15.56,8.89 14.61,9.84 14.61,23.18 16.19,24.77 | 16.19,24.77 IC17.1
N$33
  Top 0.406: IC12.5 50.16,22.54 48.9,21.27 48.9,13.34 47.62,12.06 IC5.4
  Bottom 0.406: IC20.1 16.19,12.06 17.14,13.02 46.67,13.02 47.62,12.06 IC5.4
N$34  (via drill 0.61 pad 1.27)
  Top 0.406: IC12.13 v42.55,37.78 | v53.98,37.78 53.98,15.24 52.7,13.97 IC5.6
  Bottom 0.406: v42.55,37.78 v53.98,37.78
N$36
  Bottom 0.406: IC5.11 IC5.10
N$37
  Top 0.406: IC4.4 98.74,19.68 96.2,22.23 IC4.12
  Bottom 0.406: IC4.12 96.2,27.3 98.11,29.21 127.64,29.21 IC3.8
N$38  (via drill 0.61 pad 1.27)
  Top 0.406: IC4.13 93.66,24.45 v87.95,18.73 | IC5.8 v55.24,15.56
  Bottom 0.406: v55.24,15.56 85.72,15.56 87.95,17.78 v87.95,18.73
N$40
  Bottom 0.406: IC20.10 26.35,19.68 27.3,20.64 74.61,20.64 75.56,19.68 IC19.10
N$41
  Top 0.406: IC21.11 108.27,63.82 109.54,62.55 109.54,54.29 112.08,51.75 112.08,46.67 103.5,38.1 94.61,38.1 83.82,27.3 83.82,21.91 IC19.8
N$42  (via drill 0.61 pad 1.27)
  Top 0.406: IC19.11 73.03,21.27 74.3,22.54 74.3,68.26 78.42,72.39 v79.38,72.39
  Bottom 0.406: IC21.1 131.13,73.34 128.91,71.12 86.36,71.12 85.09,72.39 v79.38,72.39
PABUS12
  Bottom 0.406: JP5.1 139.38,48.9 135.89,52.39 120.33,52.39 119.7,51.75 119.7,49.21 119.06,48.58 116.52,48.58 115.89,49.21 IC9.4
PABUS13
  Bottom 0.406: JP5.2 141.92,47.62 125.41,47.62 123.51,49.53 IC9.7
PABUS14
  Bottom 0.406: IC9.9 126.05,57.47 127.64,55.88 143.51,55.88 146.05,53.34 146.05,46.67 144.46,45.09 142.56,45.09 141.29,46.35 JP5.3
PABUS15
  Bottom 0.406: IC9.12 118.43,57.15 119.38,56.2 126.05,56.2 127.32,54.93 143.19,54.93 145.1,53.02 145.1,46.99 144.46,46.35 JP5.4
PABUS16  (via drill 0.61 pad 1.27)
  Top 0.406: v90.81,45.09 IC10.4
  Bottom 0.406: JP5.5 135.57,43.81 134.3,45.09 v90.81,45.09
PABUS17  (via drill 0.61 pad 1.27)
  Top 0.406: v98.42,46.35 IC10.7
  Bottom 0.406: JP5.6 142.56,43.81 141.29,45.09 135.57,45.09 134.3,46.35 v98.42,46.35
PABUS18  (via drill 0.61 pad 1.27)
  Top 0.406: v99.69,42.55 99.69,53.02 100.97,54.29 IC10.9
  Bottom 0.406: JP5.7 135.57,41.27 134.3,42.55 v99.69,42.55
PABUS19  (via drill 0.61 pad 1.27)
  Top 0.406: v94.61,43.81 94.61,56.83 IC10.12
  Bottom 0.406: v94.61,43.81 134.3,43.81 135.57,42.55 141.29,42.55 142.56,41.27 JP5.8
PABUS20
  Bottom 0.406: JP5.9 135.57,38.73 133.99,40.32 91.12,40.32 85.72,45.72 71.75,45.72 70.8,46.67 16.83,46.67 13.97,49.53 IC11.4
PABUS21
  Bottom 0.406: JP5.10 141.92,40.01 135.57,40.01 134.3,41.27 91.44,41.27 86.04,46.67 72.07,46.67 71.12,47.62 23.5,47.62 21.59,49.53 IC11.7

### Text on the board
Top: #1
tsilk: VCC2 | GND1 | IC7 | IC6 | 74LS245N | 74LS245N | JP3 | JP1 | IC21 | 74LS374N | MT5C6408 | MT5C6408 | IC2 | IC1 | 74LS157N | 74LS157N | 74LS157N | 74LS157N | 74LS157N | IC11 | IC10 | JP5 | IC13 | IC9 | IC14 | JP4 | JP2 | IC17 | IC12 | 74LS32N | 74LS00N | 74LS32N | IC8 | IC4 | 74LS20N | 74LS27N | IC20 | IC5 | IC3 | 74LS02N | 74LS08N | 74LS32N | GND2 | VCC1 | IC19 | 10u | JP10